# Altium schematic sheet SchematicES.SchDoc
size A4; SheetNumber: 1; SheetTotal: 2
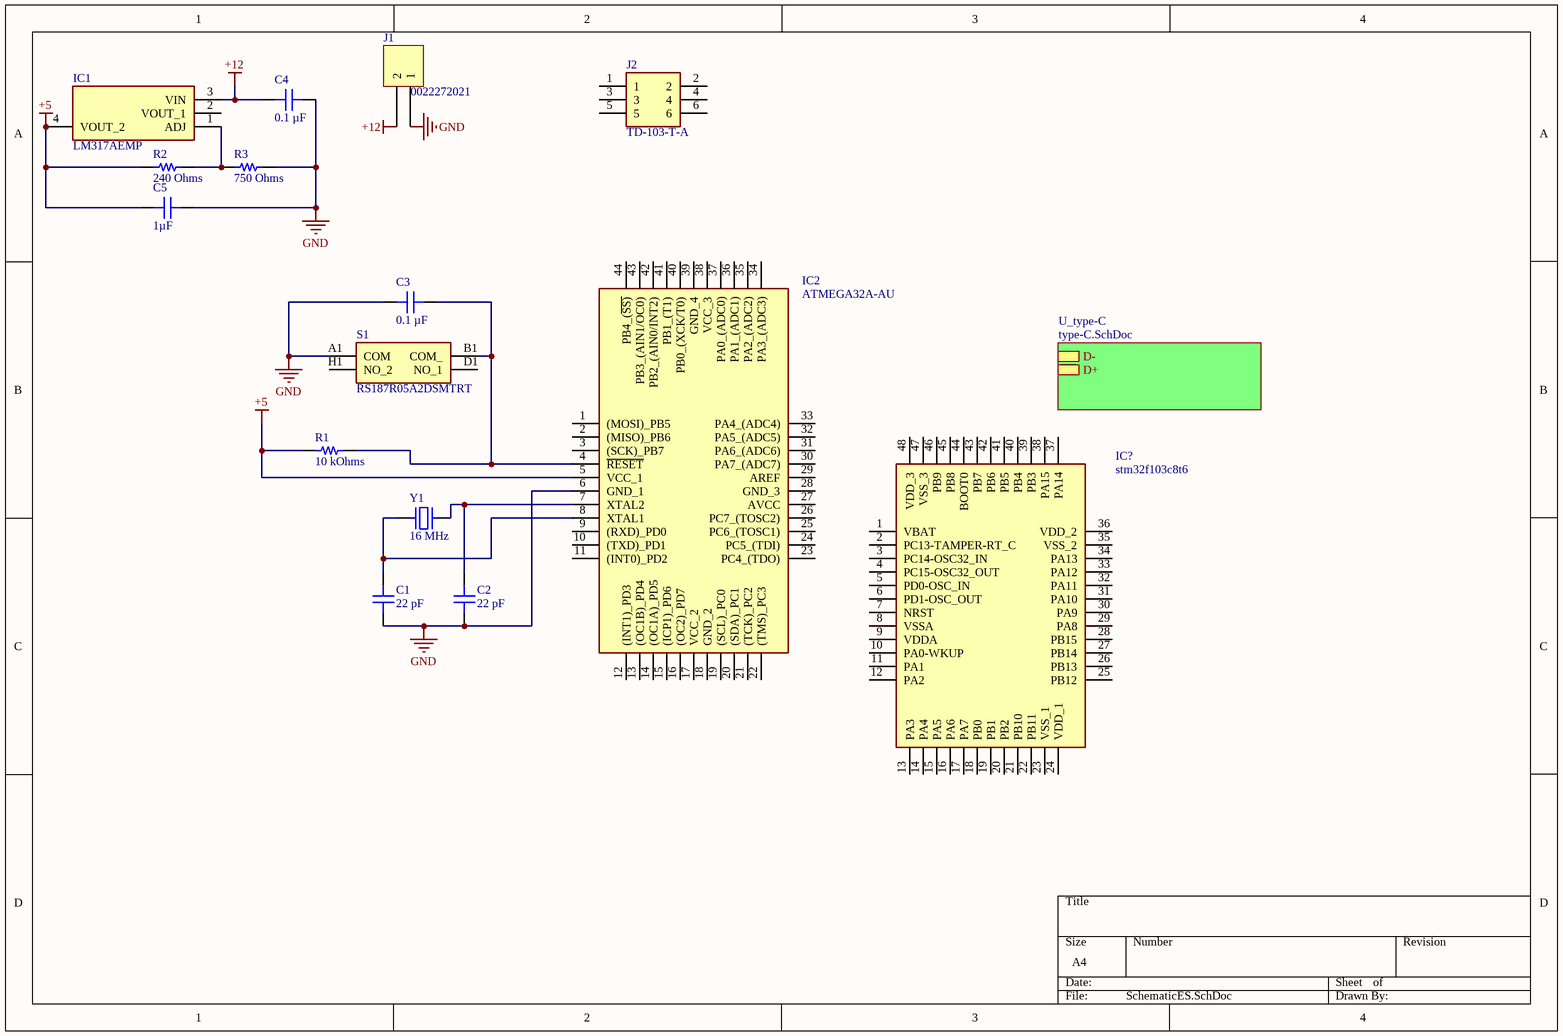
[diagram p0: SchematicES.SchDoc]

## Parts
C1  22 pF  [CAP 0805_2012]
C2  22 pF  [CAP 0805_2012]
C3  0.1 µF  [CAP 0805_2012]
C4  0.1 µF  [CAP 0805_2012]
C5  1µF  [CAP 0805_2012]
IC1  LM317AEMP  [SOT230P700X180-4N]
IC2  ATMEGA32A-AU  [QFP80P1200X1200X120-44N]
IC?  stm32f103c8t6  [QFP50P900X900X160-48N]
J1  0022272021  [MOLEX KK 0022272021]
J2  TD-103-T-A  [SAMTEC_TD-103-T-A]
R1  10 kOhms  [RES 0805_2012]
R2  240 Ohms  [RES 0805_2012]
R3  750 Ohms  [RES 0805_2012]
S1  RS187R05A2DSMTRT  [RS187R05A2DSMTRT]
Y1  16 MHz  [ABRACON ABLS]

## Sub-sheets
U_type-C = type-C.SchDoc: D-, D+

## Nets
+5: C5.1 IC1.4(VOUT_2) IC2.5(VCC_1) R1.2 R2.1
+12: C4.1 IC1.3(VIN) J1.2
GND: C1.1 C2.1 C3.2 C4.2 C5.2 IC2.6(GND_1) J1.1 R3.1 S1.A1(COM)
NetC1_2: C1.2 IC2.8(XTAL1) Y1.1
NetC2_2: C2.2 IC2.7(XTAL2) Y1.2
NetC3_1: C3.1 IC2.4(~{RESET}) R1.1 S1.B1(COM_)
NetIC1_1: IC1.1(ADJ) R2.2 R3.2

Not connected (* = marked no-connect by the designer): IC1 2(VOUT_1); IC2 1((MOSI)_PB5) 2((MISO)_PB6) 3((SCK)_PB7) 9((RXD)_PD0) 10((TXD)_PD1) 11((INT0)_PD2) 12((INT1)_PD3) 13((OC1B)_PD4) 14((OC1A)_PD5) 15((ICP1)_PD6) 16((OC2)_PD7) 17(VCC_2) 18(GND_2) 19((SCL)_PC0) 20((SDA)_PC1) 21((TCK)_PC2) 22((TMS)_PC3) 23(PC4_(TDO)) 24(PC5_(TDI)) 25(PC6_(TOSC1)) 26(PC7_(TOSC2)) 27(AVCC) 28(GND_3) 29(AREF) 30(PA7_(ADC7)) 31(PA6_(ADC6)) 32(PA5_(ADC5)) 33(PA4_(ADC4)) 34(PA3_(ADC3)) 35(PA2_(ADC2)) 36(PA1_(ADC1)) 37(PA0_(ADC0)) 38(VCC_3) 39(GND_4) 40(PB0_(XCK/T0)) 41(PB1_(T1)) 42(PB2_(AIN0/INT2)) 43(PB3_(AIN1/OC0)) 44(PB4_(~{SS)}); IC? 1(VBAT) 2(PC13-TAMPER-RT_C) 3(PC14-OSC32_IN) 4(PC15-OSC32_OUT) 5(PD0-OSC_IN) 6(PD1-OSC_OUT) 7(NRST) 8(VSSA) 9(VDDA) 10(PA0-WKUP) 11(PA1) 12(PA2) 13(PA3) 14(PA4) 15(PA5) 16(PA6) 17(PA7) 18(PB0) 19(PB1) 20(PB2) 21(PB10) 22(PB11) 23(VSS_1) 24(VDD_1) 25(PB12) 26(PB13) 27(PB14) 28(PB15) 29(PA8) 30(PA9) 31(PA10) 32(PA11) 33(PA12) 34(PA13) 35(VSS_2) 36(VDD_2) 37(PA14) 38(PA15) 39(PB3) 40(PB4) 41(PB5) 42(PB6) 43(PB7) 44(BOOT0) 45(PB8) 46(PB9) 47(VSS_3) 48(VDD_3); J2 1 2 3 4 5 6; S1 D1(NO_1) H1(NO_2)

## Notes on the sheet
- (near IC1) VIN (7-15)
  I > 500mA

## Library data of the parts
C1 C2 = 885012007030: CAP CER 22PF 25V C0G/NP0 0805; manufacturer: Würth Elektronik; Temperature Coefficient: C0G, NP0; Tolerance: ±5%; Part Number: 885012007030; Capacitance: 22 pF; Applications: General Purpose; componentlink1description: Datasheet; componentlink1url: https://katalog.we-online.de/pbs/datasheet/885012007030.pdf; componentlink2description: DigiKey Link; componentlink2url: https://www.digikey.com/en/products/detail/würth-elektronik/885012007030/5453684; Device Package: 0805 (2012 Metric); lastupdated: 2/9/2024 8:15:45 PM; Lifecycle Status: Active; Minimum Order: 1; Mounting Type: Surface Mount, MLCC; Operating Temperature: -55°C ~ 125°C; Package / Case: 0805 (2012 Metric); packaging: TapeAndReel; partid: 11788; Part Status: Active; price: 0.03; series: WCAP-CSGP; Size / Dimension: 0.079" L x 0.049" W (2.00mm x 1.25mm); Supplier 1: DigiKey; Supplier Part Number 1: 732-7829-1-ND; Thickness (Max): 0.028" (0.70mm); value: 22 pF; Voltage - Rated: 25V
C3 C4 = 0805Y0250104KXT: CAP CER 0.1UF 25V X7R 0805; manufacturer: Knowles Syfer; Tolerance: ±10%; Part Number: 0805Y0250104KXT; Capacitance: 0.1 µF; Applications: Boardflex Sensitive; componentlink1description: Datasheet; componentlink1url: https://www.knowlescapacitors.com/getattachment/2dbfc8bc-e2b3-4b4d-afb1-43b011b9ebe0/High-Std-Voltage.aspx; componentlink2description: DigiKey Link; componentlink2url: https://www.digikey.com/en/products/detail/knowles-syfer/0805Y0250104KXT/5729991; Device Package: 0805 (2012 Metric); Features: Soft Termination; lastupdated: 2/9/2024 8:16:06 PM; Lifecycle Status: Active; Minimum Order: 1; Mounting Type: Surface Mount, MLCC; Operating Temperature: -55°C ~ 125°C; Package / Case: 0805 (2012 Metric); packaging: TapeAndReel; partid: 3471; Part Status: Active; price: 0.15; series: FlexiCap™; Size / Dimension: 0.079" L x 0.049" W (2.00mm x 1.25mm); Supplier 1: DigiKey; Supplier Part Number 1: 1608-1010-1-ND; Temperature Coefficient: X7R; Thickness (Max): 0.051" (1.30mm); value: 0.1 µF; Voltage - Rated: 25V
C5 = 08053D105KAT2A: CAP CER 1UF 25V X5R 0805; manufacturer: AVX Corporation; Tolerance: ±10%; Part Number: 08053D105KAT2A; Capacitance: 1µF; Applications: General Purpose; componentlink1description: Datasheet; componentlink1url: http://datasheets.avx.com/cx5r.pdf; componentlink2description: DigiKey Link; componentlink2url: http://digikey.com/product-detail/en/avx-corporation/08053D105KAT2A/478-1409-1-ND/564441; Device Package: 0805 (2012 Metric); lastupdated: 9/2/2020 1:04:40 AM; Lifecycle Status: Active; Minimum Order: 1; Mounting Type: Surface Mount, MLCC; Operating Temperature: -55°C ~ 85°C; Package / Case: 0805 (2012 Metric); packaging: TapeAndReel; partid: 3127; Part Status: Active; price: 0.12; series: -; Size / Dimension: 0.079" L x 0.049" W (2.01mm x 1.25mm); Supplier 1: DigiKey; Supplier Part Number 1: 478-1409-1-ND; Temperature Coefficient: X5R; Thickness (Max): 0.055" (1.40mm); value: 1µF; Voltage - Rated: 25V
IC1 = LM317AEMP: Integrated Circuit; Manufacturer_Name: Texas Instruments; Datasheet Link: http://www.ti.com/general/docs/lit/getliterature.tsp?genericPartNumber=LM317A&&fileType=pdf; Height: 1.8mm; Manufacturer_Part_Number: LM317AEMP; Mouser Part Number: 926-LM317AEMP; Mouser Price/Stock: https://www.mouser.co.uk/ProductDetail/Texas-Instruments/LM317AEMP?qs=X1J7HmVL2ZGkQwt18De0Dg%3D%3D; Arrow Part Number: LM317AEMP; Arrow Price/Stock: https://www.arrow.com/en/products/lm317aemp/texas-instruments?region=europe
IC2 = ATMEGA32A-AU: Integrated Circuit; Manufacturer_Name: Microchip; Datasheet Link: https://datasheet.datasheetarchive.com/originals/distributors/Datasheets_SAMA/cdaccbc5973e6e5058248c9f4a0d56a5.pdf; Height: 1.2mm; Manufacturer_Part_Number: ATMEGA32A-AU; Mouser Part Number: 556-ATMEGA32A-AU; Mouser Price/Stock: https://www.mouser.co.uk/ProductDetail/Microchip-Technology/ATMEGA32A-AU?qs=6WoM%2FY8vMbbFYDtovr%252BQ5Q%3D%3D; Arrow Part Number: ATMEGA32A-AU; Arrow Price/Stock: https://www.arrow.com/en/products/atmega32a-au/microchip-technology?utm_currency=USD&region=nac
IC? = stm32f103c8t6: Integrated Circuit; Manufacturer_Name: STMicroelectronics; Datasheet Link: http://media.digikey.com/pdf/Data%20Sheets/ST%20Microelectronics%20PDFS/STM32F103x8,B.pdf; Height: 1.6mm; Manufacturer_Part_Number: stm32f103c8t6; Mouser Part Number: 511-STM32F103C8T6; Mouser Price/Stock: https://www.mouser.co.uk/ProductDetail/STMicroelectronics/STM32F103C8T6?qs=bhCVus9SdFtq6kqxsU5%2FDA%3D%3D; Arrow Part Number: STM32F103C8T6; Arrow Price/Stock: https://www.arrow.com/en/products/stm32f103c8t6/stmicroelectronics?utm_currency=USD&region=nac
J1 = 0022272021: CONN HEADER VERT 2POS 2.54MM; Manufacturer: Molex; Contact Length - Mating: 0.295" (7.49mm); Contact Length - Post: 0.140" (3.56mm); Material Flammability Rating: UL94 V-0; Number of Positions: 2; Number of Positions Loaded: All; Overall Contact Length: 0.560" (14.22mm); Pitch - Mating: 0.100" (2.54mm); Shrouding: Shrouded - 1 Wall; Style: Board to Cable/Wire; Part Number: 0022272021; ComponentLink1Description: Datasheet; ComponentLink1URL: https://www.molex.com/pdm_docs/sd/022272021_sd.pdf; ComponentLink2Description: DigiKey Link; ComponentLink2URL: http://digikey.com/product-detail/en/molex/0022272021/WM4111-ND/1130577; Connector Type: Header; Contact Finish - Mating: Tin; Contact Finish - Post: Tin; Contact Finish Thickness - Mating: 100.0µin (2.54µm); Contact Material: Brass; Contact Shape: Square; Contact Type: Male Pin; Fastening Type: Friction Lock; Insulation Color: Natural; Insulation Height: 0.461" (11.70mm); Insulation Material: Polyamide (PA), Nylon; LastUpdated: 1/12/2020 11:51:43 PM; Lifecycle Status: Active; Minimum Order: 1; Mounting Type: Through Hole; Number of Rows: 1; Packaging: Bulk; PartId: 76; Part Status: Active; Price: 0.27; Series: KK 6410; Supplier 1: DigiKey; Supplier Part Number 1: WM4111-ND; Termination: Solder
J2 = TD-103-T-A: Connector; Manufacturer_Name: SAMTEC; Manufacturer_Part_Number: TD-103-T-A; Mouser Part Number: 200-TD103TA; Mouser Price/Stock: https://www.mouser.com/Search/Refine.aspx?Keyword=200-TD103TA; Arrow Part Number: TD-103-T-A; Arrow Price/Stock: https://www.arrow.com/en/products/td-103-t-a/samtec
R1 = CRS0805-FX-1002ELF: RES 10K OHM 1% 1/4W 0805; Manufacturer: Bourns Inc.; Power (Watts): 0.25W, 1/4W; Temperature Coefficient: ±100ppm/°C; Part Number: CRS0805-FX-1002ELF; Value: 10 kOhms; ComponentLink1Description: Datasheet; ComponentLink1URL: https://www.bourns.com/data/global/pdfs/CRS.pdf; ComponentLink2Description: DigiKey Link; ComponentLink2URL: https://www.digikey.com/en/products/detail/bourns-inc/CRS0805-FX-1002ELF/5778731; Composition: Thick Film; Device Package: 0805 (2012 Metric); Features: High Voltage, Pulse Withstanding; Height - Seated (Max): 0.024" (0.60mm); LastUpdated: 2/8/2024 9:00:49 PM; Lifecycle Status: Active; Minimum Order: 1; Number of Terminations: 2; Operating Temperature: -55°C ~ 155°C; Package / Case: 0805 (2012 Metric); Packaging: TapeAndReel; PartId: 49386; Part Status: Active; Price: 0.02; Resistance: 10 kOhms; Series: CRS; Size / Dimension: 0.079" L x 0.049" W (2.00mm x 1.25mm); Supplier 1: DigiKey; Supplier Part Number 1: CRS0805-FX-1002ELFCT-ND; Supplier Device Package: 0805; Tolerance: ±1%
R2 = RMCF0805FT240R: RES 240 OHM 1% 1/8W 0805; Manufacturer: Stackpole Electronics Inc; Power (Watts): 0.125W, 1/8W; Temperature Coefficient: ±100ppm/°C; Part Number: RMCF0805FT240R; Value: 240 Ohms; ComponentLink1Description: Datasheet; ComponentLink1URL: https://www.seielect.com/catalog/sei-rmcf_rmcp.pdf; ComponentLink2Description: DigiKey Link; ComponentLink2URL: https://www.digikey.com/en/products/detail/stackpole-electronics-inc/RMCF0805FT240R/1712895; Composition: Thick Film; Device Package: 0805 (2012 Metric); Features: Automotive AEC-Q200; Height - Seated (Max): 0.026" (0.65mm); LastUpdated: 2/8/2024 9:01:57 PM; Lifecycle Status: Active; Minimum Order: 1; Number of Terminations: 2; Operating Temperature: -55°C ~ 155°C; Package / Case: 0805 (2012 Metric); Packaging: CutTape; PartId: 37580; Part Status: Active; Price: 0.01; Ratings: AEC-Q200; Resistance: 240 Ohms; Series: RMCF; Size / Dimension: 0.079" L x 0.049" W (2.00mm x 1.25mm); Supplier 1: DigiKey; Supplier Part Number 1: RMCF0805FT240RCT-ND; Supplier Device Package: 0805; Tolerance: ±1%
R3 = RNCF0805BTE750R: RES 750 OHM 0.1% 1/8W 0805; Manufacturer: Stackpole Electronics Inc; Power (Watts): 0.125W, 1/8W; Temperature Coefficient: ±25ppm/°C; Part Number: RNCF0805BTE750R; Value: 750 Ohms; ComponentLink1Description: Datasheet; ComponentLink1URL: https://www.seielect.com/catalog/sei-rncf.pdf; ComponentLink2Description: DigiKey Link; ComponentLink2URL: http://digikey.com/product-detail/en/stackpole-electronics-inc/RNCF0805BTE750R/RNCF0805BTE750RCT-ND/2027163; Composition: Thin Film; Device Package: 0805 (2012 Metric); Features: Automotive AEC-Q200; Height - Seated (Max): 0.026" (0.65mm); LastUpdated: 2/8/2024 9:02:34 PM; Lifecycle Status: Active; Minimum Order: 1; Number of Terminations: 2; Operating Temperature: -55°C ~ 155°C; Package / Case: 0805 (2012 Metric); Packaging: TapeAndReel; PartId: 28885; Part Status: Active; Price: 0.08; Ratings: AEC-Q200; Resistance: 750 Ohms; Series: RNCF; Size / Dimension: 0.079" L x 0.049" W (2.00mm x 1.25mm); Supplier 1: DigiKey; Supplier Part Number 1: RNCF0805BTE750RCT-ND; Supplier Device Package: 0805; Tolerance: ±0.1%
S1 = RS187R05A2DSMTRT: Switch; Manufacturer_Name: C & K COMPONENTS; Datasheet Link: https://www.mouser.com/datasheet/2/60/RS-187R05-DS_MT_RT-1160023.pdf; Height: 1.65mm; Manufacturer_Part_Number: RS187R05A2DSMTRT; Mouser Part Number: 611-RS187R05A2DSMTRT; Mouser Price/Stock: https://www.mouser.co.uk/ProductDetail/CK/RS187R05A2DSMTRT?qs=Gufeu08L%2Fl21N7VSbxt7Uw%3D%3D; Arrow Part Number: RS187R05A2DSMTRT; Arrow Price/Stock: https://www.arrow.com/en/products/rs187r05a2dsmtrt/ck?region=nac
Y1 = ABLS-16.000MHZ-20-B-3-H-T: CRYSTAL 16.0000MHZ 20PF SMD; Manufacturer: Abracon LLC; ESR (Equivalent Series Resistance): 40 Ohms; Frequency Stability: ±35ppm; Frequency Tolerance: ±25ppm; Operating Mode: Fundamental; Part Number: ABLS-16.000MHZ-20-B-3-H-T; ComponentLink1Description: Datasheet; ComponentLink1URL: https://abracon.com/Resonators/abls.pdf; ComponentLink2Description: DigiKey Link; ComponentLink2URL: https://www.digikey.com/en/products/detail/abracon-llc/ABLS-16-000MHZ-20-B-3-H-T/9997789; Frequency: 16 MHz; Height - Seated (Max): 0.165" (4.20mm); LastUpdated: 6/3/2024 8:02:02 PM; Lifecycle Status: Active; Load Capacitance: 20pF; Minimum Order: 1; Mounting Type: Surface Mount; Operating Temperature: -20°C ~ 70°C; Package / Case: HC-49/US; Packaging: TapeAndReel; PartId: 60; Part Status: Active; Price: 0.10; Series: ABLS; Size / Dimension: 0.449" L x 0.185" W (11.40mm x 4.70mm); Supplier 1: DigiKey; Supplier Part Number 1: 535-14881-1-ND; Type: MHz Crystal; Value: 16 MHz